# Altium schematic sheet Sheet1.SchDoc
size A
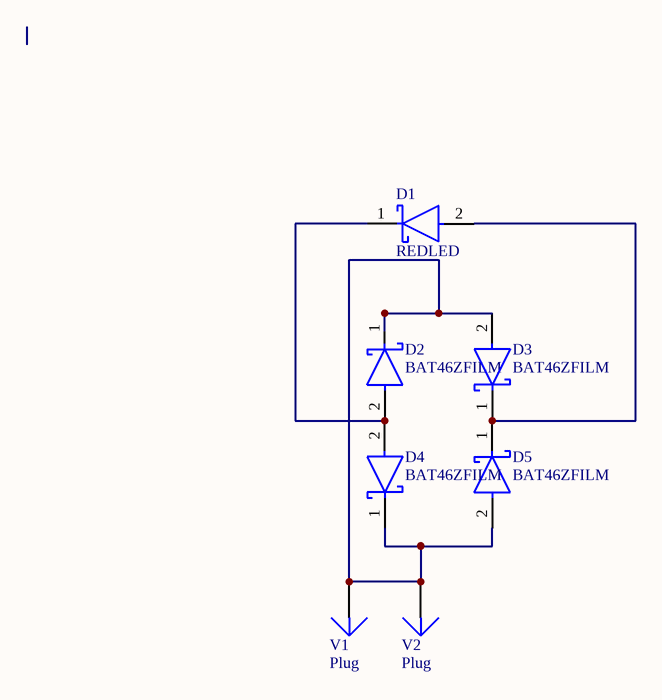
[diagram p0: Sheet1.SchDoc]

## Parts
D1  REDLED  [FP-SOD-123-MFG]
D2  BAT46ZFILM  [FP-SOD-123-MFG]
D3  BAT46ZFILM  [FP-SOD-123-MFG]
D4  BAT46ZFILM  [FP-SOD-123-MFG]
D5  BAT46ZFILM  [FP-SOD-123-MFG]
V1  Plug  [PIN1]
V2  Plug  [PIN1]

## Nets
NetD1_1: D1.1(C) D2.2(A) D4.2(A)
NetD1_2: D1.2(A) D3.1(C) D5.1(C)
NetD2_1: D2.1(C) D3.2(A) D4.1(C) D5.2(A) V1.1 V2.1

## Library data of the parts
D1 = CMP-12187-000006-1: DIODE SCHOTTKY 100V 150MA SOD123; Manufacturer: STMicroelectronics; Manufacturer Part Number: BAT46ZFILM; Max Surge Forward Current: 1A; Capacitance: 10pF; Standoff Height: 0mm; Peak Reverse Current: 5uA; Value: 10pF; Max Junction Temp: +150°C; Automotive: No; Ipc Land Pattern Name: SOD375155X145-2; Device Class L2: Diodes; Device Class L1: Discrete Semiconductors; Temperature Range High: +150°C; ComponentLink2Description: Datasheet; Lead Free: Yes; Digikey Description: DIODE SCHOTTKY 100V 150MA SOD123; RoHS: TRUE; Category: Diode; Max Repetitive Reverse Voltage: 100V; ComponentLink2URL: https://www.st.com/resource/en/datasheet/bat46.pdf; Temperature: to +150°C; Mouser Description: Schottky Diodes & Rectifiers schottky diode; Package: SOD-123; Forward Current: 150mA; Octopart: https://octopart.com/bat46zfilm-stmicroelectronics-658190; Height: 1.45mm; Device Class L3: Schottky Diodes
D2-D5 = CMP-12187-000006-1: DIODE SCHOTTKY 100V 150MA SOD123; Manufacturer: STMicroelectronics; Max Surge Forward Current: 1A; Capacitance: 10pF; Standoff Height: 0mm; Peak Reverse Current: 5uA; Value: 10pF; Max Junction Temp: +150°C; Automotive: No; Ipc Land Pattern Name: SOD375155X145-2; Device Class L2: Diodes; Device Class L1: Discrete Semiconductors; Temperature Range High: +150°C; ComponentLink2Description: Datasheet; Lead Free: Yes; Digikey Description: DIODE SCHOTTKY 100V 150MA SOD123; RoHS: TRUE; Category: Diode; Max Repetitive Reverse Voltage: 100V; ComponentLink2URL: https://www.st.com/resource/en/datasheet/bat46.pdf; Manufacturer Part Number: BAT46ZFILM; Temperature: to +150°C; Mouser Description: Schottky Diodes & Rectifiers schottky diode; Package: SOD-123; Forward Current: 150mA; Octopart: https://octopart.com/bat46zfilm-stmicroelectronics-658190; Height: 1.45mm; Device Class L3: Schottky Diodes
V1 V2 = Plug: LatestRevisionDate: 17-Jul-2002; LatestRevisionNote: Re-released for DXP Platform.; Publisher: Altium Limited